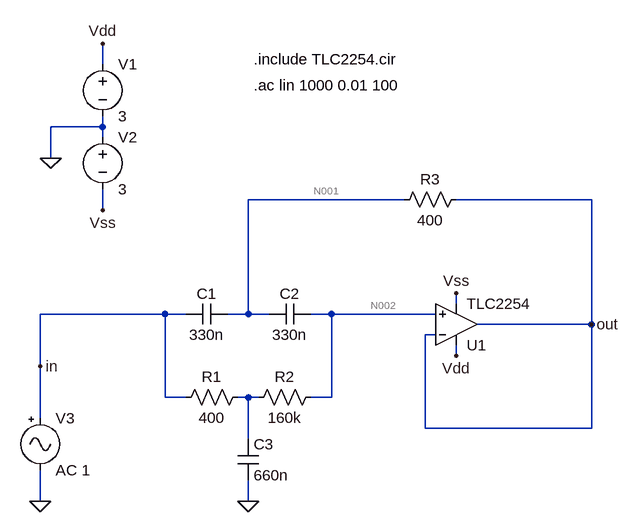
[diagram p0: schematic rejeita_faixa_vcvs_2_ordem.asc]
rejeita_faixa_vcvs_2_ordem.asc, the LTspice schematic file:
Version 4
SHEET 1 880 680
WIRE -176 -224 -176 -256
WIRE -176 -128 -176 -144
WIRE -176 -128 -256 -128
WIRE -176 -112 -176 -128
WIRE -256 -80 -256 -128
WIRE 288 -16 48 -16
WIRE 576 -16 368 -16
WIRE -176 0 -176 -32
WIRE 368 144 368 128
WIRE -80 160 -272 160
WIRE -48 160 -80 160
WIRE 48 160 48 -16
WIRE 48 160 16 160
WIRE 80 160 48 160
WIRE 176 160 144 160
WIRE 336 160 176 160
WIRE 576 176 576 -16
WIRE 576 176 400 176
WIRE 336 192 320 192
WIRE 368 224 368 208
WIRE -272 240 -272 160
WIRE -80 288 -80 160
WIRE -48 288 -80 288
WIRE 48 288 32 288
WIRE 64 288 48 288
WIRE 176 288 176 160
WIRE 176 288 144 288
WIRE -272 320 -272 240
WIRE 320 336 320 192
WIRE 576 336 576 176
WIRE 576 336 320 336
WIRE 48 352 48 288
WIRE -272 448 -272 400
WIRE 48 448 48 416
FLAG 48 448 0
FLAG -256 -80 0
FLAG -176 -256 Vdd
FLAG 368 224 Vdd
FLAG 368 128 Vss
FLAG -176 0 Vss
FLAG -272 448 0
FLAG -272 240 in
FLAG 576 176 out
SYMBOL Opamps\\TLC2254 368 240 M180
SYMATTR InstName U1
SYMATTR SpiceModel TLC2254
SYMBOL cap 16 144 R90
WINDOW 0 0 32 VBottom 2
WINDOW 3 32 32 VTop 2
SYMATTR InstName C1
SYMATTR Value 330n
SYMBOL cap 144 144 R90
WINDOW 0 0 32 VBottom 2
WINDOW 3 32 32 VTop 2
SYMATTR InstName C2
SYMATTR Value 330n
SYMBOL voltage -176 -240 R0
SYMATTR InstName V1
SYMATTR Value 3
SYMBOL voltage -176 -128 R0
SYMATTR InstName V2
SYMATTR Value 3
SYMBOL Misc\\signal -272 304 R0
WINDOW 123 0 0 Left 2
WINDOW 39 0 0 Left 2
SYMATTR InstName V3
SYMATTR Value AC 1
SYMBOL cap 32 352 R0
SYMATTR InstName C3
SYMATTR Value 660n
SYMBOL res 48 272 R90
WINDOW 0 0 56 VBottom 2
WINDOW 3 32 56 VTop 2
SYMATTR InstName R1
SYMATTR Value 400
SYMBOL res 160 272 R90
WINDOW 0 0 56 VBottom 2
WINDOW 3 32 56 VTop 2
SYMATTR InstName R2
SYMATTR Value 160k
SYMBOL res 384 -32 R90
WINDOW 0 0 56 VBottom 2
WINDOW 3 32 56 VTop 2
SYMATTR InstName R3
SYMATTR Value 400
TEXT 56 -192 Left 2 !.ac lin 1000 0.01 100
TEXT 56 -232 Left 2 !.include TLC2254.cir

The netlist it stands for:
* rejeita_faixa_vcvs_2_ordem.asc
XU1 N002 out Vdd Vss out TLC2254 TLC2254  ; pins In+ In- V+ V- OUT
C1 N001 in 330n
C2 N002 N001 330n
V1 Vdd 0 3
V2 0 Vss 3
V3 in 0 AC 1
C3 N003 0 660n
R1 N003 in 400
R2 N002 N003 160k
R3 out N001 400
.ac lin 1000 0.01 100
.include TLC2254.cir
.backanno
.end

* Results of the author's LTspice run, read from the files saved beside the schematic
* Operating Point, zero values left out:
*   V(out) = -5.627 µV
*   V(vss) = -3 V
*   V(vdd) = 3 V
*   V(n002) = -15.89 nV
*   V(n001) = -5.627 µV
*   I(V2) = -87.1 µA
*   I(V1) = -87.1 µA
*   Ix(u1:3) = 87.1 µA
*   Ix(u1:4) = -87.1 µA
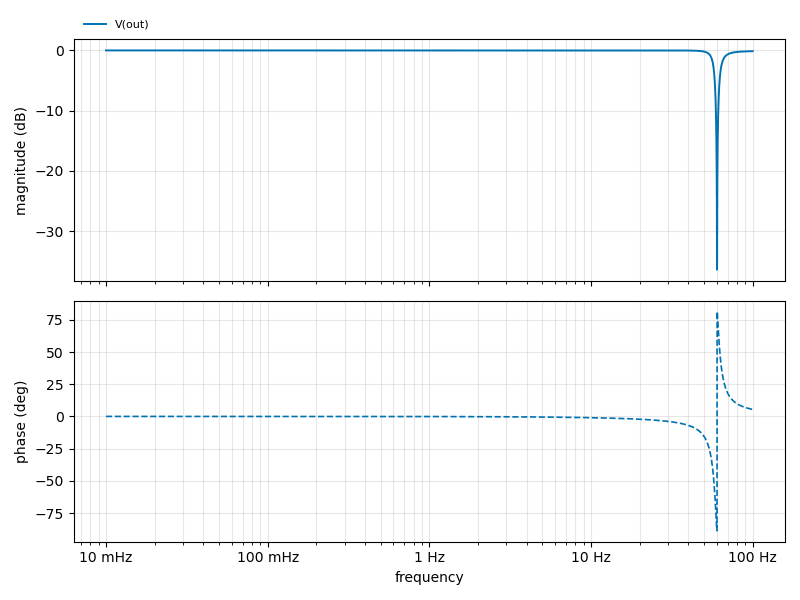
[diagram p1: AC Analysis of rejeita_faixa_vcvs_2_ordem.asc, plotted from the saved traces]
* AC Analysis, 1 run:
*   V(out): -0.00 dB at 10 mHz, -0.13 dB at 100 Hz, peak -0.00 dB at 19.83 Hz, 3 dB below the peak at 57.38 Hz